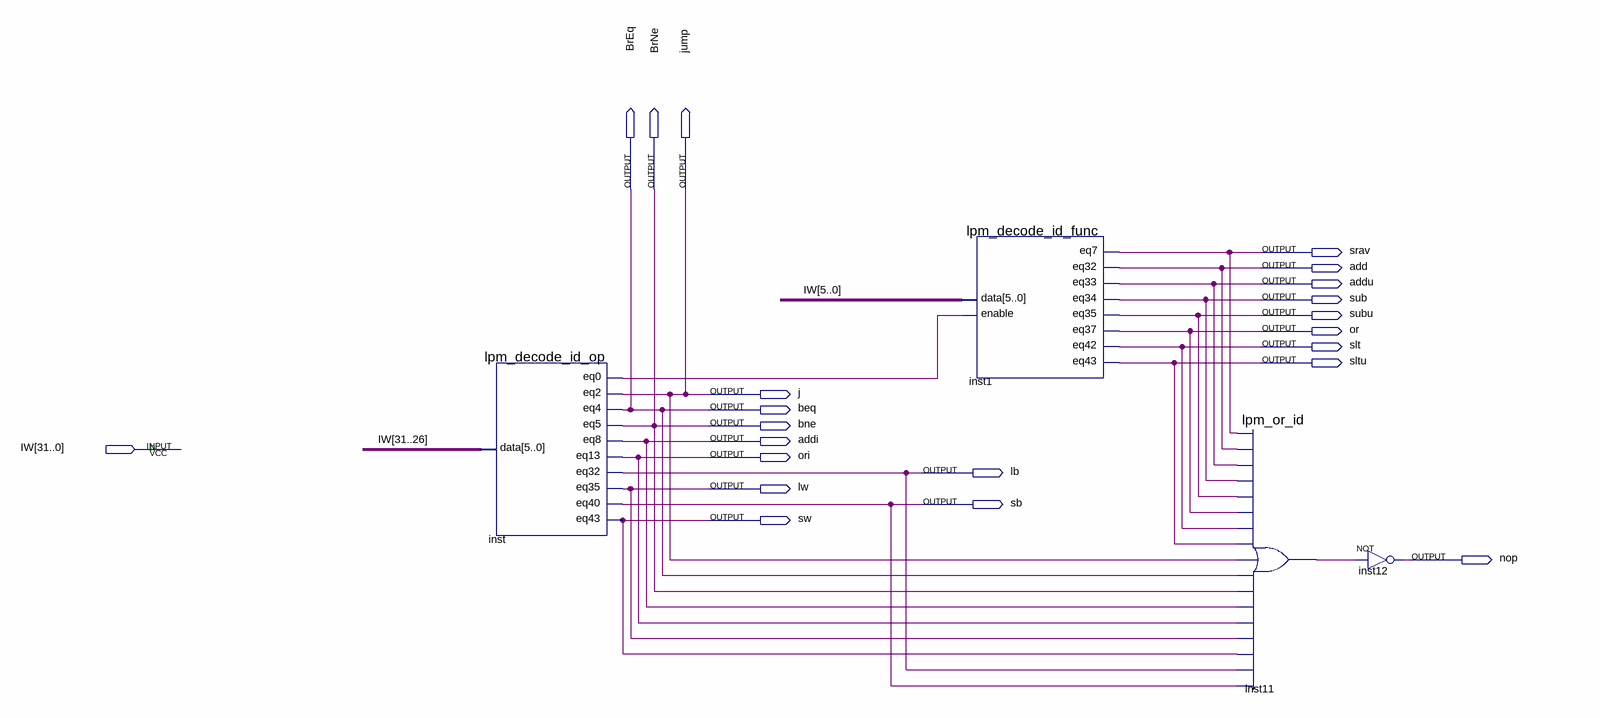
[diagram p0: schematic sheet]
// Quartus schematic ID.bdf as structural Verilog: 4 symbols, 22 pins
module ID (
  input  [31:0] IW,
  output BrEq,
  output BrNe,
  output jump,
  output srav,
  output add,
  output addu,
  output sub,
  output subu,
  output \or ,
  output slt,
  output sltu,
  output j,
  output beq,
  output bne,
  output addi,
  output ori,
  output lb,
  output lw,
  output sb,
  output sw,
  output nop
);

  wire inst11_result, inst_eq0;

  lpm_decode_id_op inst (
    .data(IW[31:26]), .eq0(inst_eq0), .eq2(j), .eq4(beq), .eq5(bne), .eq8(addi), .eq13(ori), .eq32(lb),
    .eq35(lw), .eq40(sb), .eq43(sw));
  lpm_decode_id_func inst1 (
    .data(IW[5:0]), .enable(inst_eq0), .eq7(srav), .eq32(add), .eq33(addu), .eq34(sub), .eq35(subu),
    .eq37(\or ), .eq42(slt), .eq43(sltu));
  lpm_or_id inst11 (
    .data0(srav), .data1(add), .data2(addu), .data3(sub), .data4(subu), .data5(\or ), .data6(slt),
    .data7(sltu), .data8(j), .data9(beq), .data10(bne), .data11(addi), .data12(ori), .data13(lw),
    .data14(sw), .data15(lb), .data16(sb), .result(inst11_result));
  not inst12 (nop, inst11_result);

  assign BrEq = beq;
  assign BrNe = bne;
  assign jump = j;

  // Notes on the sheet:
  //   n
endmodule
